# EAGLE design WPC-PoweredBoard-AR (EAGLE 9.0.1)
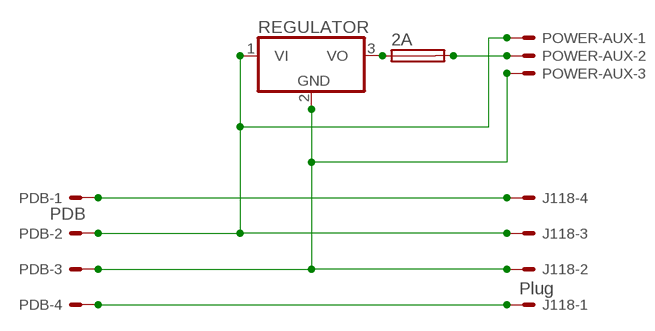
[diagram p0: schematic, sheet 1]

## Parts
2A  FUSESHK20L  [SHK20L]
J118  Plug  KK-156-4  [KK-156-4]
PDB  PDB  KK-156-4  [KK-156-4]
POWER-AUX  22-23-2031  [22-23-2031]
REGULATOR  786TV  [TO220V]

## Nets
N$1: J118.1 PDB.4
N$2: J118.3 PDB.2 POWER-AUX.1 REGULATOR.1(VI)
N$3: J118.2 PDB.3 POWER-AUX.3 REGULATOR.2(GND)
N$4: 2A.2A POWER-AUX.2
N$5: 2A.1A REGULATOR.3(VO)
N$6: J118.4 PDB.1

## Library data of the parts
2A = fuse:FUSE: Fuse; OC_FARNELL: unknown; OC_NEWARK: unknown
J118 PDB = con-molex:KK-156-4: KK 156 HEADER Source: http://www.molex.com/pdm_docs/sd/026604100_sd.pdf; MF: MOLEX; OC_FARNELL: unknown; OC_NEWARK: unknown
POWER-AUX = con-molex:22-23-2031: .100" (2.54mm) Center Header - 3 Pin; MF: MOLEX; MPN: 22-23-2031; OC_FARNELL: 1462950; OC_NEWARK: 30C0862
REGULATOR = linear:78*: Positive VOLTAGE REGULATOR Source: http://cache.national.com/ds/LM/LM78L05.pdf http://www.fairchildsemi.com/ds/LM/LM7805.pdf

## Board
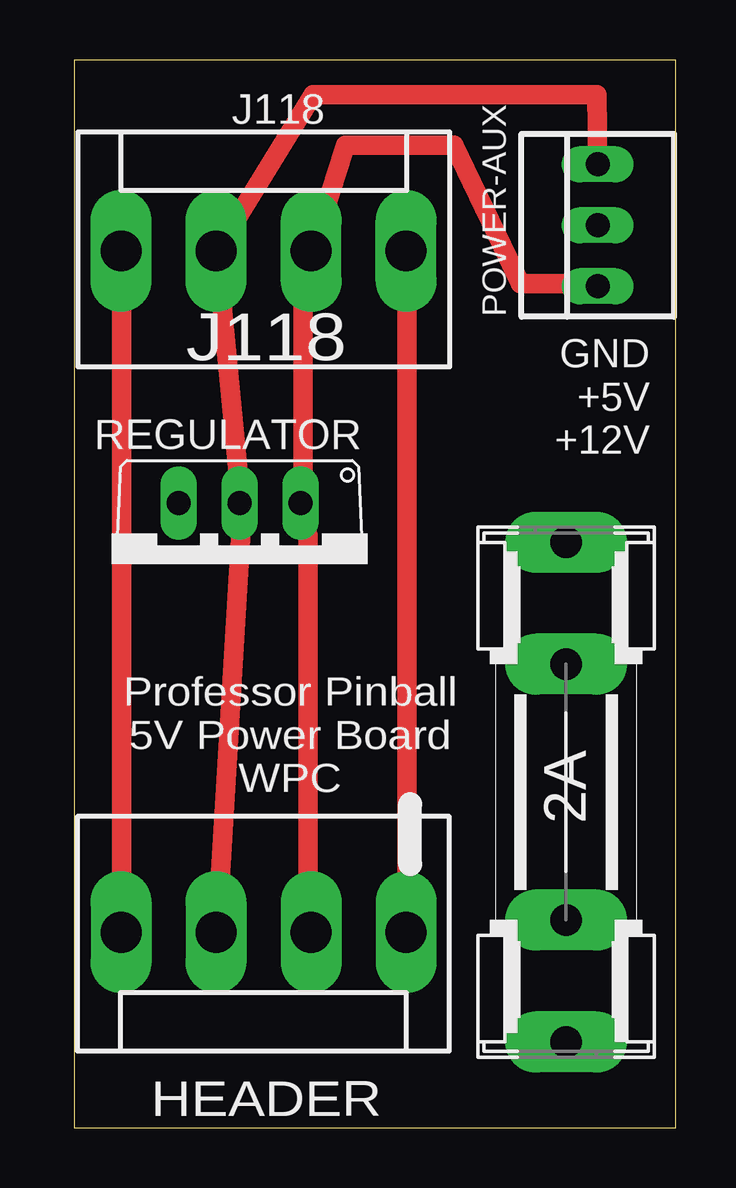
[diagram p1: board, top side]
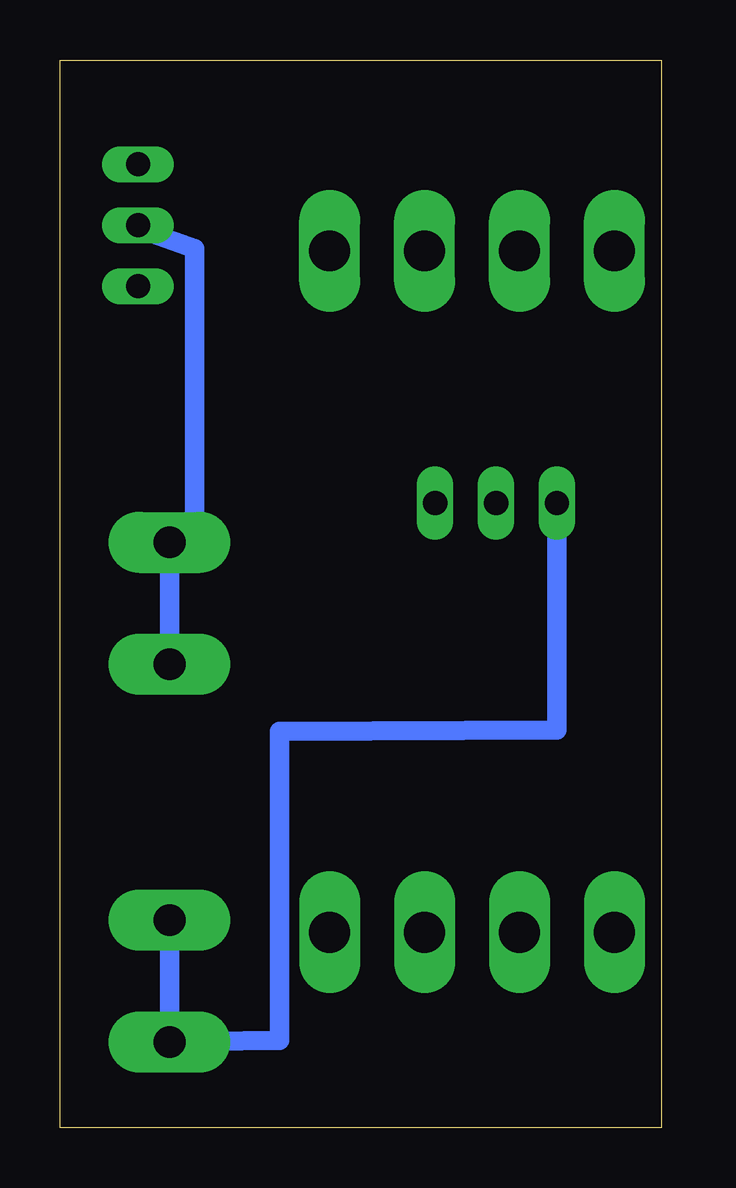
[diagram p2: board, bottom side, seen from below]

Size 25.07 x 44.52 mm. Coordinates in mm from the lower left corner, seen from the top.
Outline: 0,0 25.07,0 25.07,44.52 0,44.52 0,0
Copper layers (1*16): Top 0.035mm / dielectric 1.5mm / Bottom 0.035mm
Design rules "default": minimum track width 6mil, minimum drill 0.35mm, track to track 6mil, track to pad 6mil, pad to pad 6mil, via to via 6mil, smd to smd 6mil, copper to edge 40mil, drill to drill 6mil, minimum pad ring 10mil, minimum via ring 8mil, stop-mask expansion 4mil, vias tented up to drill 0mil, thermal gap 10mil

### Footprints (pad centres in the part's own frame; a part is rotated, then mirrored left to right if it is on the bottom)
SHK20L = drill 1.321 pad 2.54 long: 1A -10.414,0; 1B -5.334,0; 2A 10.414,0; 2B 5.334,0
KK-156-4 = drill 1.7 pad 2.184 long: 1 -5.94,0; 2 -1.98,0; 3 1.98,0; 4 5.94,0
22-23-2031 = drill 1 long: 1 -2.54,0; 2 0,0; 3 2.54,0
TO220V = drill 1.016 long: 1 -2.54,-2.54; 2 0,-2.54; 3 2.54,-2.54

### Placement (x,y rotation side)
2A  20.5,14 90 top
J118  7.89,36.56 0 top
PDB  7.89,8.16 180 top
POWER-AUX  21.82,37.63 90 top
REGULATOR  6.89,23.51 180 top

### Tracks (layer width: path | path; a pad name or v marks a point on that pad's centre or on a via)
N$1
  Top 0.813: PDB.4 1.98,8.23 1.98,36.42 J118.1
N$2
  Top 0.813: POWER-AUX.1 21.79,35.2 18.59,35.2 15.83,40.97 11.3,40.97 9.91,36.58 J118.3 9.75,36.42 9.53,34.2 9.53,26.56 REGULATOR.1 9.53,25.41 9.75,24.69 9.75,8.23 PDB.2
N$3
  Top 0.813: POWER-AUX.3 21.79,43.08 9.95,43.08 5.94,36.58 J118.2 5.94,36.42 6.94,26.06 REGULATOR.2 6.94,24.91 5.94,8.23 PDB.3
N$4
  Bottom 0.813: POWER-AUX.2 21.79,37.49 19.46,36.66 19.46,25.49 20.42,24.54 2A.2A
N$5
  Bottom 0.813: REGULATOR.3 4.35,24.41 4.35,16.6 15.92,16.53 15.92,3.66 2A.1A
N$6
  Top 0.813: PDB.1 13.87,8.23 13.87,36.42 J118.4
N$7
  Bottom 0.813: 21,24.5 20.5,24.5 20.5,19.5
N$8
  Bottom 0.813: 20.5,3.5 20.5,8.5

### Text on the board
tNames: J118 | GND / +5V / +12V | Professor Pinball / 5V Power Board / WPC | HEADER